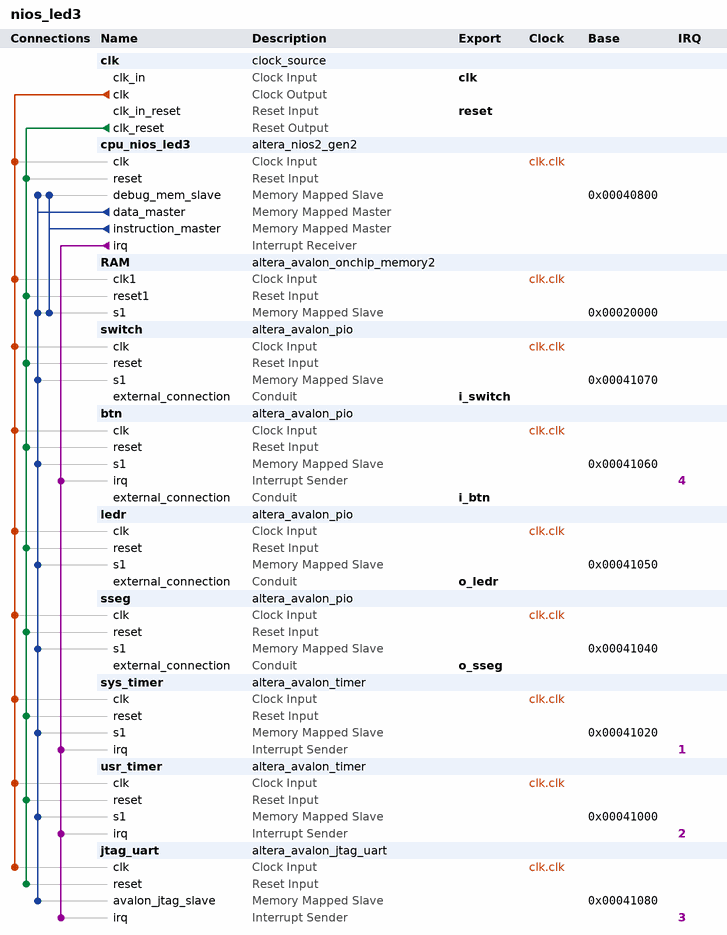
[diagram p0: system contents]
# Platform Designer (Qsys) system nios_led3, MAX 10 10M50DAF484C7G
# Parameters at their usual value, and those the tool derives, are not listed.
package require -exact qsys 23.1
create_system nios_led3
set_project_property DEVICE_FAMILY {MAX 10}
set_project_property DEVICE 10M50DAF484C7G

add_instance clk clock_source 23.1
set_instance_parameter_value clk clockFrequency 50000000

add_instance cpu_nios_led3 altera_nios2_gen2 23.1
set_instance_parameter_value cpu_nios_led3 dcache_size 2048
set_instance_parameter_value cpu_nios_led3 exceptionSlave RAM.s1
set_instance_parameter_value cpu_nios_led3 icache_size 4096
set_instance_parameter_value cpu_nios_led3 impl Tiny
set_instance_parameter_value cpu_nios_led3 resetSlave RAM.s1

add_instance RAM altera_avalon_onchip_memory2 23.1
set_instance_parameter_value RAM dataWidth 32
set_instance_parameter_value RAM dualPort false
set_instance_parameter_value RAM initMemContent true
set_instance_parameter_value RAM initializationFileName onchip_mem.hex
set_instance_parameter_value RAM memorySize 98304

add_instance switch altera_avalon_pio 23.1
set_instance_parameter_value switch direction Input
set_instance_parameter_value switch width 10

add_instance btn altera_avalon_pio 23.1
set_instance_parameter_value btn captureEdge true
set_instance_parameter_value btn direction Input
set_instance_parameter_value btn edgeType FALLING
set_instance_parameter_value btn generateIRQ true
set_instance_parameter_value btn irqType EDGE
set_instance_parameter_value btn width 2

add_instance ledr altera_avalon_pio 23.1
set_instance_parameter_value ledr direction Output
set_instance_parameter_value ledr width 2

add_instance sseg altera_avalon_pio 23.1
set_instance_parameter_value sseg direction Output
set_instance_parameter_value sseg width 32

add_instance sys_timer altera_avalon_timer 23.1
set_instance_parameter_value sys_timer period 1
set_instance_parameter_value sys_timer periodUnits MSEC

add_instance usr_timer altera_avalon_timer 23.1
set_instance_parameter_value usr_timer period 1
set_instance_parameter_value usr_timer periodUnits MSEC

add_instance jtag_uart altera_avalon_jtag_uart 23.1
set_instance_parameter_value jtag_uart simInteractiveOptions NO_INTERACTIVE_WINDOWS

# connections
add_connection clk.clk btn.clk clock
add_connection clk.clk cpu_nios_led3.clk clock
add_connection clk.clk jtag_uart.clk clock
add_connection clk.clk ledr.clk clock
add_connection clk.clk RAM.clk1 clock
add_connection clk.clk sseg.clk clock
add_connection clk.clk switch.clk clock
add_connection clk.clk sys_timer.clk clock
add_connection clk.clk usr_timer.clk clock
add_connection clk.clk_reset btn.reset reset
add_connection clk.clk_reset cpu_nios_led3.reset reset
add_connection clk.clk_reset jtag_uart.reset reset
add_connection clk.clk_reset ledr.reset reset
add_connection clk.clk_reset RAM.reset1 reset
add_connection clk.clk_reset sseg.reset reset
add_connection clk.clk_reset switch.reset reset
add_connection clk.clk_reset sys_timer.reset reset
add_connection clk.clk_reset usr_timer.reset reset
add_connection cpu_nios_led3.data_master btn.s1 avalon
set_connection_parameter_value cpu_nios_led3.data_master/btn.s1 baseAddress 0x00041060
add_connection cpu_nios_led3.data_master cpu_nios_led3.debug_mem_slave avalon
set_connection_parameter_value cpu_nios_led3.data_master/cpu_nios_led3.debug_mem_slave baseAddress 0x00040800
add_connection cpu_nios_led3.data_master jtag_uart.avalon_jtag_slave avalon
set_connection_parameter_value cpu_nios_led3.data_master/jtag_uart.avalon_jtag_slave baseAddress 0x00041080
add_connection cpu_nios_led3.data_master ledr.s1 avalon
set_connection_parameter_value cpu_nios_led3.data_master/ledr.s1 baseAddress 0x00041050
add_connection cpu_nios_led3.data_master RAM.s1 avalon
set_connection_parameter_value cpu_nios_led3.data_master/RAM.s1 baseAddress 0x00020000
add_connection cpu_nios_led3.data_master sseg.s1 avalon
set_connection_parameter_value cpu_nios_led3.data_master/sseg.s1 baseAddress 0x00041040
add_connection cpu_nios_led3.data_master switch.s1 avalon
set_connection_parameter_value cpu_nios_led3.data_master/switch.s1 baseAddress 0x00041070
add_connection cpu_nios_led3.data_master sys_timer.s1 avalon
set_connection_parameter_value cpu_nios_led3.data_master/sys_timer.s1 baseAddress 0x00041020
add_connection cpu_nios_led3.data_master usr_timer.s1 avalon
set_connection_parameter_value cpu_nios_led3.data_master/usr_timer.s1 baseAddress 0x00041000
add_connection cpu_nios_led3.instruction_master cpu_nios_led3.debug_mem_slave avalon
set_connection_parameter_value cpu_nios_led3.instruction_master/cpu_nios_led3.debug_mem_slave baseAddress 0x00040800
add_connection cpu_nios_led3.instruction_master RAM.s1 avalon
set_connection_parameter_value cpu_nios_led3.instruction_master/RAM.s1 baseAddress 0x00020000
add_connection cpu_nios_led3.irq btn.irq interrupt
set_connection_parameter_value cpu_nios_led3.irq/btn.irq irqNumber 4
add_connection cpu_nios_led3.irq jtag_uart.irq interrupt
set_connection_parameter_value cpu_nios_led3.irq/jtag_uart.irq irqNumber 3
add_connection cpu_nios_led3.irq sys_timer.irq interrupt
set_connection_parameter_value cpu_nios_led3.irq/sys_timer.irq irqNumber 1
add_connection cpu_nios_led3.irq usr_timer.irq interrupt
set_connection_parameter_value cpu_nios_led3.irq/usr_timer.irq irqNumber 2

# exported interfaces
add_interface clk clock sink
set_interface_property clk EXPORT_OF clk.clk_in
add_interface i_btn conduit end
set_interface_property i_btn EXPORT_OF btn.external_connection
add_interface i_switch conduit end
set_interface_property i_switch EXPORT_OF switch.external_connection
add_interface o_ledr conduit end
set_interface_property o_ledr EXPORT_OF ledr.external_connection
add_interface o_sseg conduit end
set_interface_property o_sseg EXPORT_OF sseg.external_connection
add_interface reset reset sink
set_interface_property reset EXPORT_OF clk.clk_in_reset

set_interconnect_requirement {$system} qsys_mm.clockCrossingAdapter HANDSHAKE
set_interconnect_requirement {$system} qsys_mm.enableEccProtection FALSE
set_interconnect_requirement {$system} qsys_mm.insertDefaultSlave FALSE
set_interconnect_requirement {$system} qsys_mm.maxAdditionalLatency 1

save_system nios_led3.qsys
